# EAGLE board SteppyMk2 (EAGLE 9.2.2)
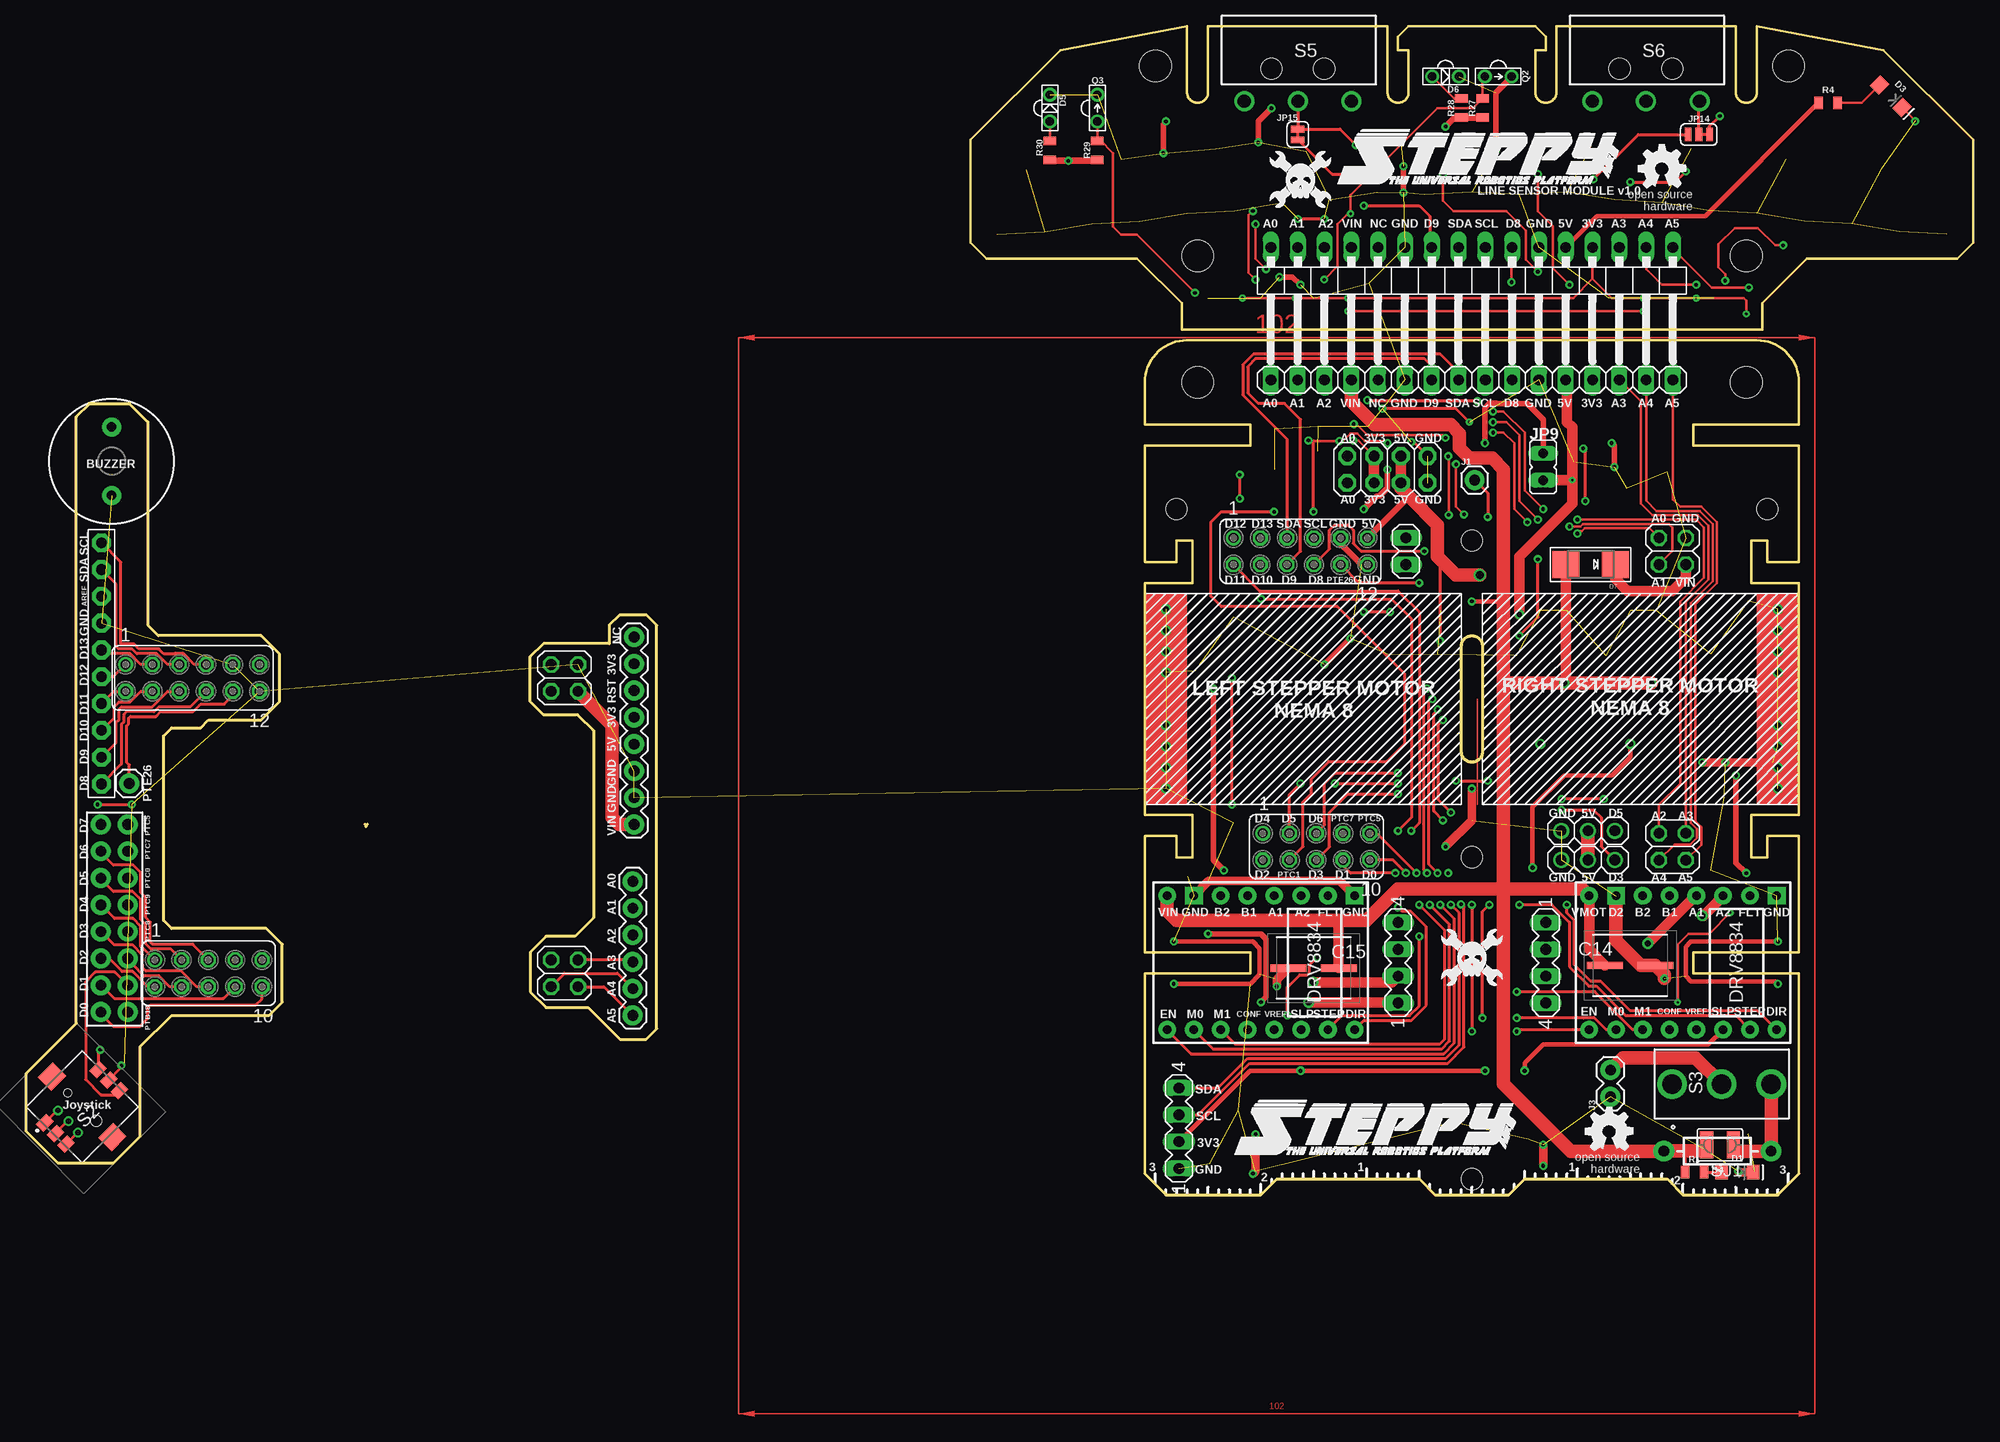
[diagram p1: board, top side]
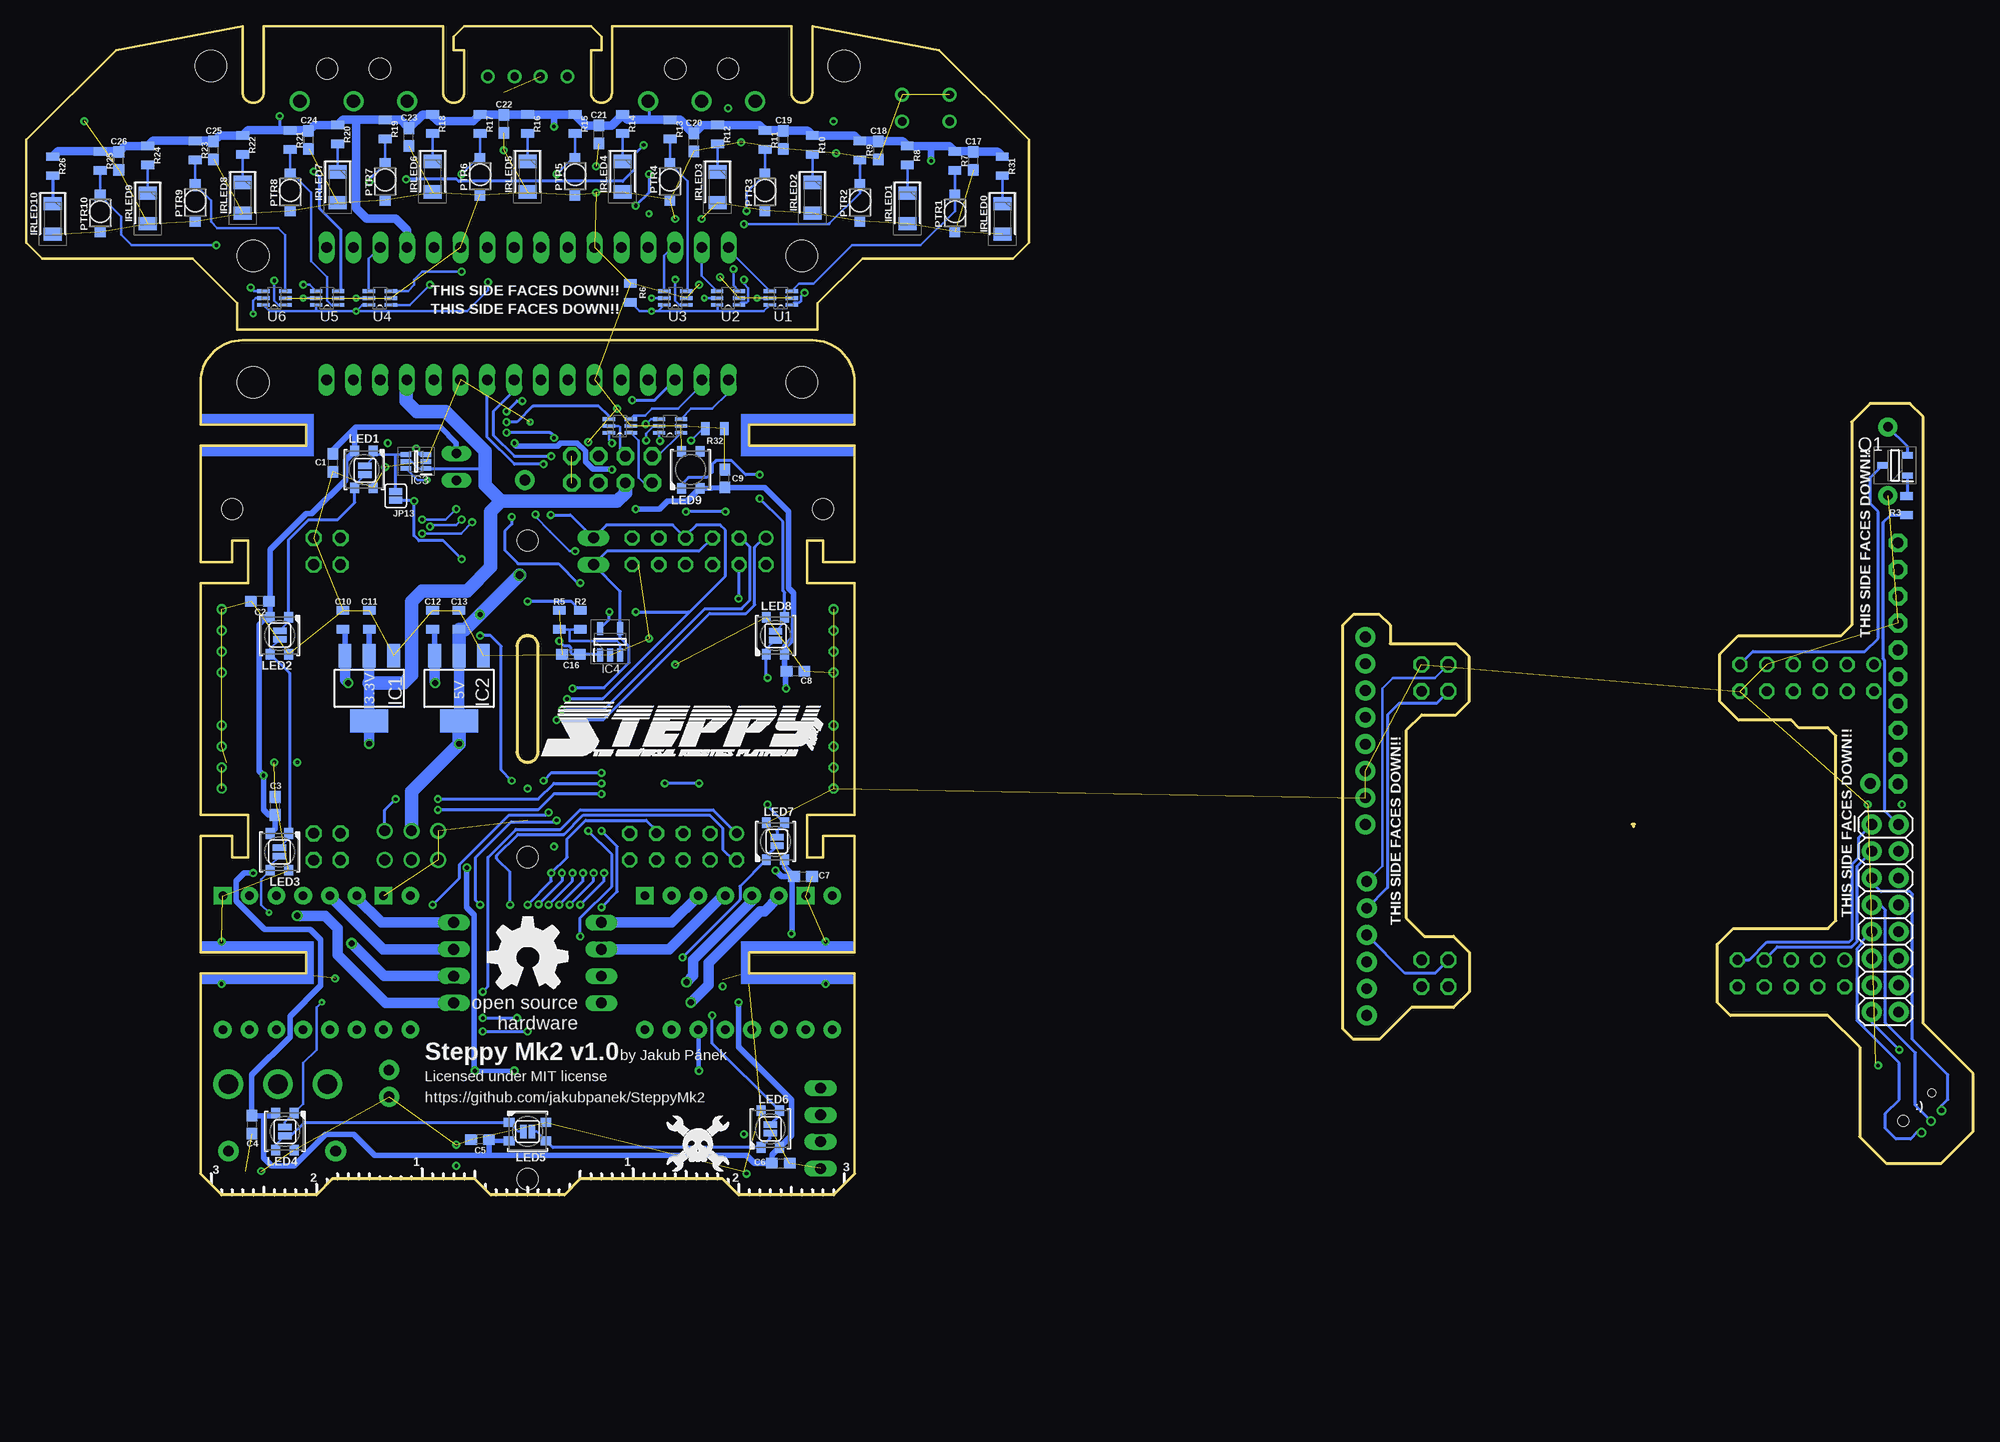
[diagram p2: board, bottom side, seen from below]

Size 184.5 x 110.75 mm. Coordinates in mm from the lower left corner, seen from the top.
Outline: 106,77 arc-90 110,81
Outline: 164,81 arc-90 168,77
Outline: 32.08,35.11 32.31,35.11
Outline: 32.18,35.09 32.18,34.91
Outline: 106,77 106,73 116,73 116,71 106,71 106,60 109,60 109,62 110.5,62 110.5,58 106,58 106,36 110.5,36 110.5,32 109,32 109,34 106,34 106,23 116,23 116,21 106,21 106,2 108,0 117,0 118.5,1.5 132,1.5 133.5,0 140.5,0 142,1.5 155.5,1.5 157,0 166,0 168,2 168,21 158,21 158,23 168,23 168,34 165,34 165,32 163.5,32 163.5,36 168,36 168,58 163.5,58 163.5,62 165,62 165,60 168,60 168,71 158,71 158,73 168,73 168,77
Outline: 106,77 arc-90 110,81
Outline: 110,81 164,81
Outline: 164,81 arc-90 168,77
Outline: 109.5,82 164.5,82 164.5,84.5 168.75,88.75 183,88.75 184.5,90.25 184.5,100 176,108.5 164,110.75 164,104.5 arc-90 163,103.5 arc-90 162,104.5 162,110.75 145,110.75 145,104.5 arc-90 144,103.5 arc-90 143,104.5 143,108.5 144,108.5 144,109.75 143,110.75 131,110.75 130,109.75 130,108.5 131,108.5 131,104.5 arc-90 130,103.5 arc-90 129,104.5 129,110.75 112,110.75 112,104.5 arc-90 111,103.5 arc-90 110,104.5 110,110.75 98,108.5 89.5,100 89.5,90.25 91,88.75 105.25,88.75 109.5,84.5 109.5,82
Outline: 8.25,3 3,3 0,6 0,11.51 4.74,16.25 4.74,73.75 5.99,75 9.75,75 11.5,73.25 11.5,54 12.5,53 22.25,53 24,51.25 24,46.75 22.25,45 17.25,45 16.5,44.25 13.75,44.25 13,43.5 13,26 13.75,25.25 22.75,25.25 24.25,23.75 24.25,18.25 23,17 13.75,17 10.75,14 10.75,5.5 8.25,3
Outline: 49.25,17.75 53.25,17.75 56.25,14.75 58.75,14.75 59.75,15.75 59.75,54 58.75,55 56.25,55 55.25,54 55.25,52.25 49,52.25 47.75,51 47.75,46.75 49,45.5 52.25,45.5 53.75,44 53.75,26.25 52,24.5 49.25,24.5 47.75,23 47.75,19.25 49.25,17.75
Outline: 136,42 136,52 arc-90 137,53 arc-90 138,52 138,42 arc-90 137,41 arc-90 136,42
Copper layers (1*16): Top 0.035mm / dielectric 1.5mm / Bottom 0.035mm
Design rules "default *": minimum track width 6mil, minimum drill 0.2mm, track to track 6mil, track to pad 6mil, pad to pad 6mil, via to via 6mil, smd to smd 6mil, copper to edge 0.2mm, drill to drill 6mil, minimum pad ring 10mil, minimum via ring 8mil, stop-mask expansion 4mil, vias tented up to drill 0mil, thermal gap 10mil
Holes 2 mm at 109,65 137,32 137,62 151,106.75 156,106.75 118,106.75 123,106.75 137,1.5 165,65
Holes 3 mm at 163,77 111,77 111,89 163,89 107,107 167,107

## Footprints (pad centres in the part's own frame; a part is rotated, then mirrored left to right if it is on the bottom)
0603 = smd 1.1 x 1: 1 -0.85,0; 2 0.85,0
0805 = smd 0.8 x 1.2: 1 -0.9,0; 2 0.9,0
CAPM7058X610N = smd 3.4 x 0.7: 1 -2.4,0; 2 2.4,0
POLOLU-DRV8825 = drill 0.8 pad 1.676: A1 6.35,-1.27; A2 6.35,-3.81; B1 6.35,1.27; B2 6.35,3.81; CONFIG -6.35,1.27; DIR -6.35,-8.89; EN -6.35,8.89; FLT 6.35,-6.35; M0 -6.35,6.35; M1 -6.35,3.81; SLP -6.35,-3.81; STEP -6.35,-6.35; VMOT 6.35,8.89; VREF -6.35,-1.27 | drill 0.8 pad 1.676 square: GND0 6.35,6.35; GND1 6.35,-8.89
LED-1206 = smd 1.2 x 1.4: A -1.5,0; C 1.5,0
DIODE-1N4001 = drill 1 pad 1.981: A -5.08,0; C 5.08,0
LTE-302 = drill 0.8: A 1.27,0; C -1.27,0
SMADIODE = smd 2.54 x 2.54: A 2.349,0; C -2.349,0
SOT223 = smd 1.219 x 2.235: 1 -2.311,-3.099; 2 0,-3.099; 3 2.311,-3.099 | smd 3.6 x 2.2: TAB 0,3.099
SOT65P210X110-6N = smd 1 x 0.45: 1 -0.95,0.65; 2 -0.95,0; 3 -0.95,-0.65; 4 0.95,-0.65; 5 0.95,0; 6 0.95,0.65
SOT95P280X145-5N = smd 1.2 x 0.6: 1 -1.25,0.95; 2 -1.25,0; 3 -1.25,-0.95; 4 1.25,-0.95; 5 1.25,0.95
LEDC3215X130N = smd 1.25 x 1.7: 1 -1.45,0; 2 1.45,0
1X01 = drill 1.016 pad 1.88: 1 0,0
1X02 = drill 1.016 pad 1.88: 1 0,0; 2 2.54,0
1X08 = drill 1.016 pad 1.88: 1 0,0; 2 2.54,0; 3 5.08,0; 4 7.62,0; 5 10.16,0; 6 12.7,0; 7 15.24,0; 8 17.78,0
1X06 = drill 1.016 pad 1.88: 1 0,0; 2 2.54,0; 3 5.08,0; 4 7.62,0; 5 10.16,0; 6 12.7,0
2X8 = drill 1.016 pad 1.88: 1 0,0; 2 0,2.54; 3 2.54,0; 4 2.54,2.54; 5 5.08,0; 6 5.08,2.54; 7 7.62,0; 8 7.62,2.54; 9 10.16,0; 10 10.16,2.54; 11 12.7,0; 12 12.7,2.54; 13 15.24,0; 14 15.24,2.54; 15 17.78,0; 16 17.78,2.54
SMT-JUMPER_2_NC_PASTE_SILK = smd 0.635 x 1.27: 1 -0.406,0; 2 0.406,0
JP1 = drill 0.914 long: 1 0,-1.27; 2 0,1.27
1X16/90 = drill 1.016 long: 1 -19.05,-3.81; 2 -16.51,-3.81; 3 -13.97,-3.81; 4 -11.43,-3.81; 5 -8.89,-3.81; 6 -6.35,-3.81; 7 -3.81,-3.81; 8 -1.27,-3.81; 9 1.27,-3.81; 10 3.81,-3.81; 11 6.35,-3.81; 12 8.89,-3.81; 13 11.43,-3.81; 14 13.97,-3.81; 15 16.51,-3.81; 16 19.05,-3.81
1X16 = drill 1.016 long: 1 -19.05,0; 2 -16.51,0; 3 -13.97,0; 4 -11.43,0; 5 -8.89,0; 6 -6.35,0; 7 -3.81,0; 8 -1.27,0; 9 1.27,0; 10 3.81,0; 11 6.35,0; 12 8.89,0; 13 11.43,0; 14 13.97,0; 15 16.51,0; 16 19.05,0
2X04 = drill 1.016 pad 1.676 octagon: 1 -3.81,-1.27; 2 -3.81,1.27; 3 -1.27,-1.27; 4 -1.27,1.27; 5 1.27,-1.27; 6 1.27,1.27; 7 3.81,-1.27; 8 3.81,1.27
SMT-JUMPER_3_1-NC_TRACE_SILK = smd 0.635 x 1.27: 1 -1.016,0; 2 0,0; 3 1.016,0
SMT-JUMPER_2_NC_TRACE_SILK = smd 0.635 x 1.27: 1 -0.508,0; 2 0.508,0
2X02 = drill 1.016 octagon: 1 -1.27,-1.27; 2 -1.27,1.27; 3 1.27,-1.27; 4 1.27,1.27
1X03 = drill 1.016: 1 -2.54,0; 2 0,0; 3 2.54,0
1X02' = drill 1.016 long: 1 -1.27,0; 2 1.27,0
LED3535 = smd 1 x 0.85: 1 -1.75,0.875; 2 -1.75,-0.875; 3 1.75,-0.875; 4 1.75,0.875
BUZZER-12MM = drill 0.9 pad 1.778: + 3.25,0; - -3.25,0
TEMT1020 = smd 1.1 x 1: 1 -1.7,0; 2 1.7,0
SOT96P237X111-3N = smd 1 x 0.6: 1 -1.2,0.955; 2 -1.2,-0.955; 3 1.2,0
LTR-301 = drill 0.8: C 1.27,0; E -1.27,0
SKRHABE010 = smd 1.35 x 1: 1 -3.575,1.425; 2 -3.575,0; 3 -3.575,-1.425; 4 3.575,1.425; 5 3.575,0; 6 3.575,-1.425 | smd 2 x 1.8: 7 0,4.05; 8 0,-4.05 | hole 0.75: 0,1.9 | hole 1.05: 0,-1.9
5MS1S102AM2QES = drill 1.85 pad 2.8: 1 0,-4.7; 2 0,0; 3 0,4.7
AH186061A = drill 1.25 pad 1.9: 1 -5.08,1.6; 2 0,1.6; 3 5.08,1.6
SJW = smd 1.27 x 2.54: 1 -1.27,0; 2 1.27,0
MA04-1 = drill 1.016 long: 1 -3.81,0; 2 -1.27,0; 3 1.27,0; 4 3.81,0
FE05-2 = drill 0.914: 1 -5.08,1.27 | drill 0.914 octagon: 2 -5.08,-1.27; 3 -2.54,1.27; 4 -2.54,-1.27; 5 0,1.27; 6 0,-1.27; 7 2.54,1.27; 8 2.54,-1.27; 9 5.08,1.27; 10 5.08,-1.27
FE06-2 = drill 0.914: 1 -6.35,1.27 | drill 0.914 octagon: 2 -6.35,-1.27; 3 -3.81,1.27; 4 -3.81,-1.27; 5 -1.27,1.27; 6 -1.27,-1.27; 7 1.27,1.27; 8 1.27,-1.27; 9 3.81,1.27; 10 3.81,-1.27; 11 6.35,1.27; 12 6.35,-1.27
SOT65P210X110-6N' = smd 1.168 x 0.356: 1 -1.041,0.66; 2 -1.041,0; 3 -1.041,-0.66; 4 1.041,-0.66; 5 1.041,0; 6 1.041,0.66
1X10-BIG = drill 1.016 pad 1.778 octagon: 1 -11.43,0; 2 -8.89,0; 3 -6.35,0; 4 -3.81,0; 5 -1.27,0; 6 1.27,0; 7 3.81,0; 8 6.35,0; 9 8.89,0; 10 11.43,0

## Placement (x,y rotation side)
C1  0.1uF  [0603]  155.46,69.39 270 bottom
C2  0.1uF  [0603]  162.36,56.27 180 bottom
C3  0.1uF  [0603]  160.92,36.86 90 bottom
C4  0.1uF  [0603]  163.14,6.64 270 bottom
C5  0.1uF  [0603]  141.5,5.25 180 bottom
C6  0.1uF  [0603]  113,3 0 bottom
C7  0.1uF  [0603]  110.89,30.18 0 bottom
C8  0.1uF  [0603]  111.61,49.63 0 bottom
C9  0.1uF  [0603]  118.31,67.89 90 bottom
C10  10uF  [0805]  154.5,54.5 90 bottom
C11  10uF  [0805]  152,54.5 90 bottom
C12  10uF  [0805]  146,54.5 90 bottom
C13  10uF  [0805]  143.5,54.5 90 bottom
C14  100UF  [CAPM7058X610N]  152,21.75 180 top
C15  100UF  [CAPM7058X610N]  122,21.5 0 top
C16  0.1uF  [0603]  132.88,51.23 180 bottom
C17  0.1uF  [0603]  94.75,98 90 bottom
C18  0.1uF  [0603]  103.75,99 90 bottom
C19  0.1uF  [0603]  112.75,100 90 bottom
C20  0.1uF  [0603]  121.25,99.75 90 bottom
C21  0.1uF  [0603]  130.25,100.5 90 bottom
C22  0.1uF  [0603]  139.25,101.5 90 bottom
C23  0.1uF  [0603]  148.25,100.25 90 bottom
C24  0.1uF  [0603]  157.75,100 90 bottom
C25  0.1uF  [0603]  166.75,99 90 bottom
C26  0.1uF  [0603]  175.75,98 90 bottom
CONLEFT  POLOLU-DRV8825  [POLOLU-DRV8825]  157,22 90 top
D1  GREEN  [LED-1206]  162.15,2.15 0 top
D3  GREEN  [LED-1206]  176.7,104.14 315 top
D4  P2000A  [DIODE-1N4001]  160.27,4.14 180 top
D5  [LTE-302]  97,103 270 top
D6  [LTE-302]  134.5,106 180 top
D7  [SMADIODE]  148.25,59.75 180 top
GOLD_ORB_SM1  OSHWLOGOLOGO8MM  [OSHW_8MM]  137,22.5 0 bottom
GOLD_ORB_SM2  OSHWLOGOLOGO5MM  [OSHW_5MM]  150,6 0 top
GOLD_ORB_SM3  OSHWLOGOLOGO5MM  [OSHW_5MM]  155,97.25 0 top
IC1  AP1117E33G-13  [SOT223]  152,48 180 bottom
IC2  TS1117BCW-5.0  [SOT223]  143.5,48 180 bottom
IC3  74LVC1T45GW,125  [SOT65P210X110-6N]  147.57,69.51 180 bottom
IC4  MCP3021A0T-E_OT  [SOT95P280X145-5N]  129.17,52.42 90 bottom
IRLED0  LL-S150IRC-2A  [LEDC3215X130N]  92,92.5 270 bottom
IRLED1  LL-S150IRC-2A  [LEDC3215X130N]  101,93.5 270 bottom
IRLED2  LL-S150IRC-2A  [LEDC3215X130N]  110,94.5 270 bottom
IRLED3  LL-S150IRC-2A  [LEDC3215X130N]  119,95.5 270 bottom
IRLED4  LL-S150IRC-2A  [LEDC3215X130N]  128,96.5 270 bottom
IRLED5  LL-S150IRC-2A  [LEDC3215X130N]  137,96.5 270 bottom
IRLED6  LL-S150IRC-2A  [LEDC3215X130N]  146,96.5 270 bottom
IRLED7  LL-S150IRC-2A  [LEDC3215X130N]  155,95.5 270 bottom
IRLED8  LL-S150IRC-2A  [LEDC3215X130N]  164,94.5 270 bottom
IRLED9  LL-S150IRC-2A  [LEDC3215X130N]  173,93.5 270 bottom
IRLED10  LL-S150IRC-2A  [LEDC3215X130N]  182,92.5 270 bottom
J1  [1X01]  137.25,67.75 0 top
J3  [1X02]  150.13,9.29 90 top
J5  [1X08]  57.59,52.88 270 top
J6  [1X06]  57.47,29.71 270 top
J7  [1X01]  9.75,39 0 top
J8  [2X8]  9.6,35.1 270 bottom
JP1  JUMPER-SMT_2_NC_PASTE_SILK  [SMT-JUMPER_2_NC_PASTE_SILK]  152.4,68.68 270 bottom
JP2  JUMPER-SMT_2_NC_PASTE_SILK  [SMT-JUMPER_2_NC_PASTE_SILK]  160.48,53.06 270 bottom
JP3  JUMPER-SMT_2_NC_PASTE_SILK  [SMT-JUMPER_2_NC_PASTE_SILK]  160.5,32.5 270 bottom
JP4  JUMPER-SMT_2_NC_PASTE_SILK  [SMT-JUMPER_2_NC_PASTE_SILK]  160,6 270 bottom
JP5  JUMPER-SMT_2_NC_PASTE_SILK  [SMT-JUMPER_2_NC_PASTE_SILK]  137,6 0 bottom
JP6  JUMPER-SMT_2_NC_PASTE_SILK  [SMT-JUMPER_2_NC_PASTE_SILK]  114,6.25 90 bottom
JP7  JUMPER-SMT_2_NC_PASTE_SILK  [SMT-JUMPER_2_NC_PASTE_SILK]  113.36,33.5 90 bottom
JP8  JUMPER-SMT_2_NC_PASTE_SILK  [SMT-JUMPER_2_NC_PASTE_SILK]  113.5,53 90 bottom
JP9  [JP1]  143.75,69 180 top
JP10  [1X16/90]  137,86 180 top
JP11  [1X16]  137,77.25 0 top
JP12  [2X04]  129,68.75 0 top
JP13  JUMPER-SMT_2_NC_PASTE_SILK  [SMT-JUMPER_2_NC_PASTE_SILK]  149.5,66.25 90 bottom
JP14  JUMPER-SMT_3_1-NC_TRACE_SILK  [SMT-JUMPER_3_1-NC_TRACE_SILK]  158.5,100.5 0 top
JP15  JUMPER-SMT_2_NC_TRACE_SILK  [SMT-JUMPER_2_NC_TRACE_SILK]  120.5,100.5 90 top
JP21  [2X02]  51,49 270 top
JP22  [2X02]  51,21 270 top
JP23  [2X02]  156,61 270 top
JP24  [1X03]  148,34.5 0 top
JP25  [1X03]  148,31.75 0 top
JP26  [2X02]  156,33 270 top
JP27  [1X02']  130.75,61 90 top
LED1  WS2812B3535  [LED3535]  152.5,68.75 270 bottom
LED2  WS2812B3535  [LED3535]  160.5,53 270 bottom
LED3  WS2812B3535  [LED3535]  160.5,32.5 270 bottom
LED4  WS2812B3535  [LED3535]  160,6 270 bottom
LED5  WS2812B3535  [LED3535]  137,6 0 bottom
LED6  WS2812B3535  [LED3535]  114,6.25 90 bottom
LED7  WS2812B3535  [LED3535]  113.5,33.5 90 bottom
LED8  WS2812B3535  [LED3535]  113.5,53 90 bottom
LED9  WS2812B3535  [LED3535]  121.54,68.73 90 bottom
LS1  BUZZER-PTH  [BUZZER-12MM]  8.08,69.53 90 top
PTR1  TEMT1020  [TEMT1020]  96.5,93 270 bottom
PTR2  TEMT1020  [TEMT1020]  105.5,94 270 bottom
PTR3  TEMT1020  [TEMT1020]  114.5,95 270 bottom
PTR4  TEMT1020  [TEMT1020]  123.5,96 270 bottom
PTR5  TEMT1020  [TEMT1020]  132.5,96.5 270 bottom
PTR6  TEMT1020  [TEMT1020]  141.5,96.5 270 bottom
PTR7  TEMT1020  [TEMT1020]  150.5,96 270 bottom
PTR8  TEMT1020  [TEMT1020]  159.5,95 270 bottom
PTR9  TEMT1020  [TEMT1020]  168.5,94 270 bottom
PTR10  TEMT1020  [TEMT1020]  177.5,93 270 bottom
Q1  SBC817-40LT1G  [SOT96P237X111-3N]  7.4,69.13 180 bottom
Q2  [LTR-301]  139.5,106 180 top
Q3  [LTR-301]  101.5,103 270 top
R1  1K  [0805]  158.09,2.14 0 top
R2  10K  [0805]  132,54.5 270 bottom
R3  4.7K  [0805]  6.31,65.33 270 bottom
R4  330  [0805]  170.75,103.5 0 top
R5  10K  [0805]  134,54.5 90 bottom
R6  330K  [0805]  127.25,85.5 270 bottom
R7  10K  [0805]  96.5,98 270 bottom
R8  330  [0805]  101,98.5 270 bottom
R9  10K  [0805]  105.5,99 270 bottom
R10  330  [0805]  110,99.5 270 bottom
R11  10K  [0805]  114.5,100 270 bottom
R12  330  [0805]  119,100.5 270 bottom
R13  10K  [0805]  123.5,101 270 bottom
R14  330  [0805]  128,101.5 270 bottom
R15  10K  [0805]  132.5,101.5 270 bottom
R16  330  [0805]  137,101.5 270 bottom
R17  10K  [0805]  141.5,101.5 270 bottom
R18  330  [0805]  146,101.5 270 bottom
R19  10K  [0805]  150.5,101 270 bottom
R20  330  [0805]  155,100.5 270 bottom
R21  10K  [0805]  159.5,100 270 bottom
R22  330  [0805]  164,99.5 270 bottom
R23  10K  [0805]  168.5,99 270 bottom
R24  330  [0805]  173,98.5 270 bottom
R25  10K  [0805]  177.5,98 270 bottom
R26  330  [0805]  182,97.5 270 bottom
R27  10K  [0805]  138,103 90 top
R28  330  [0805]  136,103 90 top
R29  10K  [0805]  101.5,99 90 top
R30  330  [0805]  97,99 90 top
R31  330  [0805]  92,97.5 270 bottom
R32  330K  [0805]  119.25,72.62 180 bottom
S2  SKRHABE010  [SKRHABE010]  5.28,8.34 45 top
S3  5MS1S102AM2QES  [5MS1S102AM2QES]  160.67,10.51 270 top
S5  AH186061A  [AH186061A]  120.5,105.25 180 top
S6  AH186061A  [AH186061A]  153.5,105.25 180 top
SJ1  [SJW]  160.5,4.75 180 top
SV1  [MA04-1]  130,22 90 top
SV2  [MA04-1]  144,22 270 top
SV3  [MA04-1]  109.23,6.31 90 top
SV4  [FE05-2]  17.25,21 0 top
SV5  [FE06-2]  15.75,49 0 top
SV6  [FE05-2]  122.25,33 0 top
SV7  [FE06-2]  120.75,61 0 top
U1  NC7SB3157P6X  [SOT65P210X110-6N']  113,85 180 bottom
U2  NC7SB3157P6X  [SOT65P210X110-6N']  118,85 180 bottom
U3  NC7SB3157P6X  [SOT65P210X110-6N']  123,85 180 bottom
U4  NC7SB3157P6X  [SOT65P210X110-6N']  151,85 180 bottom
U5  NC7SB3157P6X  [SOT65P210X110-6N']  156,85 180 bottom
U6  NC7SB3157P6X  [SOT65P210X110-6N']  161,85 180 bottom
U7  NC7SB3157P6X  [SOT65P210X110-6N']  123.5,72.88 180 bottom
U8  NC7SB3157P6X  [SOT65P210X110-6N']  128.25,72.88 180 bottom
U$1  PINHD-1X10  [1X10-BIG]  7.12,50.38 90 top
U$2  POLOLU-DRV8825  [POLOLU-DRV8825]  117,22 90 top

## Tracks (layer width: path | path; a pad name or v marks a point on that pad's centre or on a via)
3V3REG  (via drill 0.35, 0.4, 0.55)
  Top 0.254: JP12.4 126.25,71.5 v125.75,71.5
  Top 0.406: SV3.2 115.94,11.75 v120.75,11.75 v138.25,11.75 | v142,11.75 142,12.5 143.75,14.25 159.41,14.25 CONLEFT.SLP | v142.75,31 142.75,36.75 145.75,39.75 150.25,39.75 152,41.5 v152,42.75
  Top 1.016: JP12.3 JP12.4
  Bottom 0.254: IC3.1 147.36,68.86 147.93,69.43 148.45,69.43 | JP12.4 128.25,70.54 128.25,72.75 128.38,72.88 U8.5 | U7.5 124.59,72.92 124.99,72.92 125.75,72.16 v125.75,71.5
  Bottom 0.305: 148.45,69.43 IC3.5 | IC3.1 141.11,68.86 141,68.75
  Bottom 0.406: v120.75,11.75 120.81,11.81 U$2.SLP | v138.25,11.75 v142,11.75
  Bottom 0.508: IC1.2 C11.1 | v142.75,31 142.78,30.97 142.78,27.26 142.07,26.54 142.07,11.82 v142,11.75
  Bottom 1.016: IC1.2 152,48.5 IC1.TAB v152,42.75
  Bottom 1.27: 152,48.5 148.75,48.5 148,49.25 148,56.25 147,57.25 142.75,57.25 140.5,59.5 140.5,64.75 139.5,65.75 | JP12.3 127.73,66.52 128.5,65.75 139.5,65.75 | 139.5,65.75 141,67.25 141,68.75 141,70.5 144.75,74.25 147.5,74.25 148.5,75.25 148.5,77.18 JP11.13
3V3REG_  (via drill 0.25, 0.35)
  Top 0.254: v115.25,85 v120.25,85 v125.25,85 146.62,85 148.43,86.82 | 148.43,86.82 150.25,85 v153.25,85 v158.25,85 162.77,85 163,84.77 v163,83.5 | 148.43,86.82 JP10.4
  Top 0.305: JP14.3 159.52,101.27 v160.5,102.25
  Top 0.61: R30.1 97.1,98 v98.75,98 101.4,98 R29.1 | v134.5,101.25 135.35,102.1 R28.1 R27.1
  Bottom 0.254: U2.5 v120.25,85 | v115.25,85 U1.5 | U3.5 v125.25,85 | U4.5 v153.25,85 | U5.5 v158.25,85 | U6.5 162.75,85 163,84.75 v163,83.5
  Bottom 0.305: v160.5,102.25 160.5,100.9 | S5.1 125.5,103.57 125.5,101.9 | R18.1 146.17,102.4
  Bottom 0.61: 98.5,99.4 98.75,99.15 v98.75,98 | 134.5,102.4 v134.5,101.25
  Bottom 0.813: 139.2,102.4 arc-90 C22.2 | R26.1 181.5,98.9 R25.1 175.8,98.9 C26.2 175.2,99.4 R24.1 172.5,99.9 R23.1 166.8,99.9 C25.2 166.2,100.4 R22.1 163.5,100.9 160.5,100.9 R21.1 157.8,100.9 C24.2 157.2,101.4 R20.1 154.5,101.9 153.25,101.9 | 153.25,101.9 R19.1 149.05,101.9 C23.2 146.95,102.4 146.17,102.4 145.52,101.75 142.15,101.75 R17.1 139.3,102.4 C22.2 | C22.2 139.2,102.4 | 139.2,102.4 R16.1 134.5,102.4 R15.1 131.45,101.35 C21.2 129.05,101.35 R14.1 127.5,101.9 125.5,101.9 R13.1 122.55,101.9 C20.2 120.45,101.4 R12.1 115,101.4 R11.1 112.8,100.9 C19.2 110.45,100.85 R10.1 106,100.4 R9.1 103.8,99.9 C18.2 101.45,99.85 R8.1 98.5,99.4 97,99.4 R7.1 94.8,98.9 C17.2 92.45,98.85 R31.1 | JP10.4 148.43,91.43 149.5,92.5 152.25,92.5 153.25,93.5 153.25,101.9
5VREG  (via drill 0.2, 0.35, 0.5, 0.55, 0.75)
  Top 0.305: v134,52.5 134,60.25 133.75,60.5
  Top 0.406: 130.75,65.92 130.95,66.12 131.12,66.12
  Top 0.508: SV7.11 130.75,65.92
  Top 1.016: v141.5,55 141.5,60.5 146.5,65.5 v146.5,67.75 | JP12.5 JP12.6 | v146.5,67.75 146.5,72.75 146,73.25 146,77.14 JP11.12 | JP9.2 146.48,67.73 v146.5,67.75
  Top 1.27: v137.75,58.75 135.5,58.75 133.75,60.5 133.75,63.5 131.12,66.12 130.27,66.98 JP12.5 | JP25.2 JP24.2
  Bottom 0.254: IC3.6 147.41,67.75 v146.5,67.75
  Bottom 0.305: IC4.1 130.19,51.23 C16.1 132.73,51.23 132.87,51.37 132.87,51.86 133.05,52.04 133.54,52.04 v134,52.5
  Bottom 1.016: IC2.TAB IC2.2
  Bottom 1.27: JP24.2 148,38.25 v143.5,42.75 IC2.TAB | IC2.2 C13.1 142.9,53.6 v141.5,55 v137.75,58.75
5VREG*
  Bottom 0.305: SV5.11 20.87,51.5 10.25,51.5 9,52.75 9,64.75 9.75,65.5 9.75,67.98 Q1.3
5VREG_
  Top 0.406: JP10.5 148.83,92.75 159.1,92.75 R4.1
A0  (via drill 0.35)
  Top 0.254: JP23.1 153.81,63.19 147.69,63.19 147.44,62.94 147.25,62.94 v147,62.69 | v139,72.25 140,72.25 141,71.25 141,65 v142.25,63.75 | v125.8,73.05 126.05,73.05 127.1,72 134.25,72 v134.5,71.75
  Bottom 0.254: v147,62.69 143.31,62.69 v142.25,63.75 | U7.4 125.32,73.53 v125.8,73.05
  Bottom 0.305: v134.5,71.75 arc-90 135,72.25 v139,72.25
A0*
  Bottom 0.254: JP21.1 51,49 55,49 56,48 56,31.17 J6.1
A0A
  Bottom 0.254: R7.2 PTR1.1 96.5,93.25 99.75,90 106.26,90 109.91,86.36 111.26,86.36 U1.3
A0B  (via drill 0.35)
  Top 0.254: R29.2 101.5,100 | 101.5,100 Q3.C | 101.5,100 101.75,100 103,98.75 103,91.75 103.75,91 105.25,91 v110.75,85.5
  Bottom 0.254: v110.75,85.5 110.8,85.5 111.09,85.2 111.09,84.71 111.26,84.54 111.75,84.54 U1.1
A0C
  Bottom 0.254: U7.3 121.49,74.5 119.5,74.5 117.95,76.05 JP11.1
A0D
  Bottom 0.254: U7.1 124.67,70 125.17,70 JP12.2
A0S
  Bottom 0.254: U1.4 117.95,89.57 JP10.16
A1  (via drill 0.35)
  Top 0.254: JP23.3 156,61 156,63.25 155.66,63.59 147.52,63.59 147.27,63.34 v146.25,63.34 | v139,73.25 140.25,73.25 141.5,72 141.5,65.75 v143.25,64
  Bottom 0.254: v146.25,63.34 146.25,63.5 143.75,63.5 v143.25,64
  Bottom 0.305: U8.4 129.29,73.79 130.25,74.75 136.5,74.75 138,73.25 v139,73.25
A1*
  Bottom 0.305: J6.2 55.5,29.13 55.5,45.5 54.41,46.59 50.87,46.59 JP21.3
A1A  (via drill 0.35)
  Top 0.254: v117.5,87.75 116.5,88.75 v116.5,92
  Bottom 0.254: R9.2 PTR2.1 105.5,94.95 108.37,92.08 108.37,92.06 108.43,92 v116.5,92 | U2.3 117.5,86.2 v117.5,87.75
A1B  (via drill 0.35)
  Top 0.254: v116.25,93.25 115.84,92.84 115.84,87.41 v116.5,86.75
  Bottom 0.254: R11.2 114.5,96.75 | 114.5,96.75 PTR3.1 | U2.1 116.75,84.54 116.26,84.54 116.09,84.71 116.09,85.95 116.5,86.36 v116.5,86.75 | v116.25,93.25 116.25,95 114.5,96.75
A1C
  Bottom 0.254: U8.3 126.9,73.84 125.86,73.84 125.2,74.5 122.75,74.5 120.49,76.76 JP11.2
A1D
  Bottom 0.254: JP12.1 125.98,67.48 126.5,68 126.5,71.51 U8.1
A1S
  Bottom 0.254: U2.4 120.49,87.11 JP10.15
A2  (via drill 0.35)
  Top 0.254: JP26.1 154.73,36.98 156.75,39 156.75,56.25 159,58.5 159,63.25 158.25,64 v147,64 | v143.75,65 142,66.75 142,72.25 140,74.25 v139,74.25
  Top 0.305: v137.5,75.25 127.15,75.25 v127.07,75.32
  Bottom 0.254: v147,64 144.75,64 v143.75,65
  Bottom 0.305: v139,74.25 138,75.25 v137.5,75.25 | JP11.3 124.96,75.32 v127.07,75.32
A2*
  Bottom 0.305: JP22.1 51,21 53.84,21 J6.3
A2A
  Bottom 0.254: R13.2 123.5,97.75 | 123.5,97.75 PTR4.1 | U3.3 121.81,85.81 121.81,96.06 123.5,97.75
A2B  (via drill 0.25, 0.3)
  Top 0.254: Q2.C 138,105.77 R27.2 137.1,103 133.75,103 125.5,94.75 v125.5,93 125.25,93 124.25,92 124.25,90.55 124.25,88 v123,86.75
  Bottom 0.254: U3.1 122.59,84.34 123,84.75 v123,86.75
A2S
  Bottom 0.254: U3.4 124.04,89.04 123.27,89.81 JP10.14
A3
  Top 0.254: JP26.2 157.27,56.2 159.41,58.33 159.41,63.42 158.42,64.41 154.09,64.41 153,65.5 153,75.22 JP11.14
A3*
  Top 0.305: J6.4 57.28,22.27 JP22.2
A3A  (via drill 0.35 pad 0.6)
  Top 0.254: v143.25,87.5 142.13,88.62 142.13,91.37 140.25,93.25 135.25,93.25 134.25,94.25 v134.25,96.75
  Bottom 0.254: R15.2 PTR5.1 132.8,98.2 v134.25,96.75 | v143.25,87.5 147,87.5 147.75,86.75 147.75,86.25 148.34,85.66 U4.3
A3B  (via drill 0.35 pad 0.6)
  Top 0.254: v146.25,86.25 144.67,87.83 144.67,91.83 143.25,93.25 v143.25,96.75
  Bottom 0.254: R17.2 PTR6.1 141.8,98.2 v143.25,96.75 | U4.1 148.16,84.34 v146.25,86.25
A3S
  Bottom 0.254: U4.4 152.04,88.72 150.97,89.79 JP10.3
A4
  Top 0.254: JP26.3 156.23,33.23 157.7,33.23 158.31,33.84 158.31,34.7 157.75,35.26 157.75,56.1 159.81,58.16 159.81,63.59 158.59,64.81 154.5,64.81 153.51,65.8 JP11.15
A4*
  Top 0.254: J6.5
  Top 0.305: JP22.3 51,21 56.01,21 J6.5
A4A  (via drill 0.35)
  Top 0.305: v152,96 156.25,96 v157.25,97
  Bottom 0.254: R19.2 PTR7.1
  Bottom 0.305: PTR7.1 152,96.2 v152,96 | v157.25,97 156.75,96.5 156.75,93.5 154.71,91.46 154.71,85.71 154.76,85.66 U5.3
A4B
  Bottom 0.254: R21.2 159.5,96.75 | 159.5,96.75 PTR8.1 | U5.1 155.59,84.34 156,84.75 156,87 157.5,88.5 157.5,95 159.25,96.75 159.5,96.75
A4S  (via drill 0.35 pad 0.6)
  Top 0.254: JP10.2 153.51,87.74 155,86.25 v158.25,86.25
  Bottom 0.254: U5.4 157.63,86.25 v158.25,86.25
A5
  Top 0.254: JP26.4 158.72,33.18 158.72,34.87 158.16,35.43 158.16,55.93 160.22,57.99 160.22,63.75 158.75,65.22 156.75,65.22 156.05,65.92 JP11.16
A5*
  Top 0.305: JP22.4 54.75,19.73 J6.6
A5A
  Bottom 0.254: R23.2 PTR9.1 168.45,95.7 167,94.25 167,92.25 166.39,91.64 160.64,91.64 159.96,90.96 U6.3
A5B  (via drill 0.35)
  Top 0.254: v161,86.66 161,87.26 160.36,87.91 160.36,90.09 161.91,91.64 164.09,91.64 165.74,90 v166.5,90
  Bottom 0.254: R25.2 PTR10.1 175.5,92.7 175.5,91 174.5,90 v166.5,90 | U6.1 160.59,84.34 161,84.75 v161,86.66
A5S  (via drill 0.35)
  Top 0.254: JP10.1 156.05,89.7 159.75,86 v163.25,86
  Bottom 0.254: v163.25,86 162.91,85.66 U6.4
D0  (via drill 0.35)
  Top 0.305: U$2.M0 112.47,13.83 134.14,13.83 134.88,14.57 134.88,25.62 v133,27.5 | v130.75,30.5 129.52,31.73 SV6.10
  Bottom 0.305: v133,27.5 130.75,29.75 v130.75,30.5
D0*
  Top 0.305: J8.16 7.06,17.15 8.25,15.96 10.75,15.96 11.5,16.71 11.5,17.75 11.75,18 21.75,18 22.33,18.58 SV4.10
D1  (via drill 0.35)
  Top 0.305: U$2.M1 114.55,14.29 133.95,14.29 134.42,14.76 134.42,25.08 v132,27.5 | v129.75,30.5 125.5,30.5 124.79,31.21 SV6.8
  Bottom 0.305: v132,27.5 129.75,29.75 v129.75,30.5
D1*
  Top 0.305: J8.14 8.3,18.62 18.68,18.62 SV4.8
D2  (via drill 0.35)
  Top 0.305: CONLEFT.M0 149.73,15.65 148.58,16.79 147.64,16.79 147.59,16.75 v141.25,16.75 | v138,16.75 138,26.84 v138.66,27.5
  Bottom 0.305: v141.25,16.75 v138,16.75 | v138.66,27.5 138.66,30.59 139.92,31.85 139.92,32.15 137.9,34.17 133.55,34.17 131.72,36 119.75,36 118.5,34.75 118.5,32.75 117.48,31.73 SV6.2
D2*
  Top 0.305: SV4.2 11.49,19.73 10.06,21.16 9.08,21.16 7.84,22.41 J8.12
D3  (via drill 0.35)
  Top 0.305: SV6.6 123.5,32.98 123.5,36.25 125.25,38 v130,38 | v145.5,36.5 148.5,36.5 149.25,35.75 149.25,33.04 JP25.3
  Bottom 0.305: v130,38 134.5,38 136,36.5 v145.5,36.5
D3*
  Top 0.305: SV4.6 16.15,19.73 14.67,21.2 11.33,21.2 11.02,21.51 11,22.25 11,22.76 10.06,23.7 8.3,23.7 J8.10
D4  (via drill 0.35)
  Top 0.305: CONLEFT.M1 152.27,15.65 148.66,19.26 142.8,19.26 142.79,19.25 v141.25,19.25
  Bottom 0.305: v141.25,19.25 140.75,19.75 140.75,32 138.11,34.64 133.86,34.64 132,36.5 119.4,36.5 SV6.1
D4*
  Top 0.305: SV4.1 10.94,23.5 10.91,23.5 10.83,23.58 10.83,24.42 10.84,24.43 10.84,25.46 10.11,26.19 8.35,26.19 J8.8
D5  (via drill 0.35)
  Top 0.305: SV6.3 119.71,37.96 v120.75,39 | v124,39 v130,39 | v149.5,37.5 v145.5,37.5
  Bottom 0.305: v120.75,39 v124,39 | JP24.3 150.54,36.46 v149.5,37.5 | v145.5,37.5 136,37.5 134.5,39 v130,39
D5*
  Top 0.305: SV4.3 13.69,23.29 11.8,23.29 11.3,23.79 11.3,25.65 10.84,26.11 10.84,28 10.09,28.75 8.25,28.75 7.06,29.94 J8.6
D6  (via drill 0.35)
  Top 0.305: SV6.5 123.04,35.06 123.04,39.01 124.03,40 v130,40 | v135.5,39.25 v138.5,39.25 | v141.5,53 143.25,54.75 v143.25,60.25 | v147.75,65.75 147.75,70.54 v147.54,70.75
  Bottom 0.305: v130,40 134.75,40 v135.5,39.25 | v138.5,39.25 139.5,40.25 139.5,52 140.5,53 v141.5,53 | v143.25,60.25 145,62 147.28,62 147.75,62.47 v147.75,65.75 147.84,65.84 JP13.1 | v147.54,70.75 147.54,70.5 147.19,70.16 IC3.3
D6*
  Top 0.305: SV4.5 15.78,23.74 12.01,23.74 11.76,23.99 11.76,25.84 11.3,26.3 11.3,28.19 10.84,28.65 10.84,30.54 10.11,31.27 9.08,31.27 9.06,31.25 8.25,31.25 7.06,32.44 J8.4
D7*
  Bottom 0.305: J8.2 7.11,35.1 8.38,36.38 8.38,50.69 8.5,50.81 8.5,63.75 7.82,64.43 R3.2
D8  (via drill 0.35)
  Top 0.254: v136.25,64.5 135.5,65.25 v135.5,69.25
  Top 0.305: SV7.8 123.5,61.21 123.5,63 124,63.5 125.25,63.5 125.75,63 125.75,61.75 126.5,61 v132.5,61
  Bottom 0.254: v132.5,61 133,61 134.86,62.86 134.86,62.89 136.25,64.28 v136.25,64.5
  Bottom 0.305: v135.5,69.25 138.25,69.25 140.81,71.81 JP11.10
D8*
  Top 0.305: SV5.8 15.54,46.25 12.54,46.25 12.09,45.8 9.5,45.8 9.23,45.53 9.23,44.84 9,44.61 9,40.82 U$1.1
D8_  (via drill 0.25, 0.35 pad 0.6)
  Top 0.254: v153.25,83.75 v125.25,83.75 | v140.75,86.5 140.75,89.75 JP10.7
  Bottom 0.254: U4.6 152.66,84.34 v153.25,83.75 | v153.25,83.75 157,83.75 | 157,83.75 161.45,83.75 U6.6 | U5.6 157.04,83.79 157,83.75 | U1.6 114.63,83.75 119,83.75 | 119,83.75 v125.25,83.75 | U3.6 124.63,83.75 v125.25,83.75 | U2.6 119,84.3 119,83.75 | v125.25,83.75 126.4,83.75 R6.2 | v153.25,83.75 142.75,83.75 140.75,85.75 v140.75,86.5
D9
  Top 0.305: JP11.7 133.19,78.56 132.5,79.25 116.5,79.25 115.75,78.5 115.75,76 116.75,75 119.25,75 120.75,73.5 120.75,61 SV7.6
D9*
  Top 0.305: U$1.2 8.5,42.86 8.5,44.75 8.78,45.03 8.78,46.03 9.01,46.26 11.9,46.26 13.38,47.73 SV5.6
D9_  (via drill 0.35)
  Top 0.305: JP15.1 123.74,96.75 v125.5,96.75 | v126.75,93.75 132,93.75 133,92.75 133,90 JP10.10
  Bottom 0.305: v125.5,96.75 125.5,95 v126.75,93.75
D10  (via drill 0.35)
  Top 0.305: U$2.DIR 126.78,16.54 131.27,16.54 132.68,17.96 132.68,25.4 131.2,26.88 130.37,26.88 v130,27.25 | v130,34.5 131.29,35.79 131.29,54.56 129.43,56.43 117.07,56.43 v117,56.5
  Bottom 0.305: v130,27.25 128.5,28.75 128.5,33 v130,34.5 | v117,56.5 116.94,56.56 SV7.4
D10*
  Top 0.305: U$1.3 8.32,45.22 8.32,46.25 8.78,46.71 9.82,46.71 10.84,47.73 SV5.4
D11  (via drill 0.35)
  Top 0.305: U$2.STEP 124.7,17 131.08,17 132,17.92 v132,24.5 | v131.25,34.5 132,35.25 132,55.25 130,57.25 116.88,57.25 SV7.2
  Bottom 0.305: v132,24.5 132,26.25 129,29.25 129,32.25 v131.25,34.5
D11*
  Top 0.305: U$1.4 8.29,47.73 SV5.2
D12  (via drill 0.35)
  Top 0.305: CONLEFT.DIR 164.08,17.46 152,17.46 149.21,20.25 148.25,20.25 146.71,21.79 146.71,26.02 146,26.73 v146,27.5 | v135,36.25 133.83,37.42 133.83,44.58 v134.25,45
  Bottom 0.305: v135,36.25 135.25,36 138.75,36 143.46,31.29 143.46,30.04 v146,27.5 | v134.25,45 134.18,45.07 129.79,45.07 119.74,55.11 116.28,55.11 115.47,55.92 115.47,61.39 114.58,62.27 SV7.1
D12*
  Top 0.305: U$1.5 8.23,49.1 SV5.1
D13  (via drill 0.35)
  Top 0.305: CONLEFT.STEP 162,17 151.56,17 148.77,19.79 148.06,19.79 146.25,21.6 146.25,25.83 144.58,27.5 v141.5,27.5 | v134.25,35.5 133.37,36.38 133.37,45.62 v133.75,46
  Bottom 0.305: v141.5,27.5 141.96,27.96 141.96,31.94 138.55,35.35 134.4,35.35 v134.25,35.5 | v133.75,46 129.75,46 120.18,55.57 116.72,55.57 115.92,56.36 115.92,61.4 116.79,62.27 SV7.3
D13*
  Top 0.305: SV5.3 10.84,50.27 9.82,51.29 7.48,51.29 U$1.6
GND  (via drill 0.25, 0.35, 0.55)  (129 unrouted)
  Top 0.254: D3.C 179.04,101.8 v179,101.75
  Top 0.305: D1.C 163.75,2.24 | v6.75,37 v10,37 | S2.5 9,12.06 v9,12.25 | JP12.8 131.49,71.34 v131.25,71.34 | v136.75,73.25 135.5,74.5 v128.5,74.5 | v120.5,92.5 v123,92.5
  Top 0.406: v108.75,20 116,20 116.88,20.88 116.88,23.37 116.25,24 v108.75,24 | v166,20 165.75,20.25 157.75,20.25 157.25,20.75 157.25,23.5 157.75,24 v166,24
  Top 0.508: v150.5,69 150.5,71 v150.25,71.25 | Q2.E 139.25,104.48 v139.25,99 | v130.5,97.5 v130.5,95 | v118,103 116.75,101.75 v116.75,99.75 | v108,101.75 107.75,101.5 v107.75,98.75 | v120.75,86.25 120,87 v118.75,87
  Top 0.61: SV7.9 124.56,61.69 126.52,59.73 SV7.12 | v123,50.25 v125.5,52.75
  Top 0.813: v143.75,4.75 v143.75,2.75 | D1.C 162.35,2.15 v162.25,2.25 | C15.1 118.5,20.4 v118.5,19.75 | v166,40.5 165.5,41 v161,41 158.84,41 | v134.5,33 137,35.5 v137,38.5 | U$2.GND0 112.05,29.75 124.49,29.75 U$2.GND1 | v116.5,5.75 116.5,2.25 v116.25,2
  Top 1.27: CONLEFT.GND0 150.65,24.1 153,21.75 C14.1 155.25,20.9 v155.25,20.5
  Bottom 0.203: v9,12.25 9.25,12.5
  Bottom 0.305: 151.62,67.03 LED1.4
  other vias: 166,38.5 166,42.5 166,44.5 166,49.5 108,44.5 108,42.5 108,40.5 108,38.5 108,49.5 108,51.5 108,53.5 108,55.5 166,55.5 166,53.5 166,51.5 158.81,41
N$1
  Bottom 0.254: R22.2 IRLED8.1
N$2
  Bottom 0.254: R8.2 IRLED1.1
N$3
  Top 0.254: R28.2 135.33,103.9 D6.A
N$4
  Top 1.016: JP23.4 157.27,58.52 156,57.25 151.75,57.25 150.6,58.4 D7.C
N$5
  Top 0.305: JP14.2 158.5,103.57 S6.1
N$6
  Bottom 0.254: R31.2 IRLED0.1
N$7
  Bottom 0.254: JP1.1 151.62,69.86 151.62,70 | 151.62,70 LED1.1 | IC3.4 149.5,70.16 151.47,70.16 151.62,70
  Bottom 0.305: JP13.2 149.5,70.16
N$8
  Bottom 0.254: JP3.1 159.62,33.78 159.62,34 LED3.1 | JP2.2 161.38,51.77 LED2.3
  Bottom 0.305: 159.62,34 159.57,34.06 159.57,49.44 LED2.3
N$9  (via drill 0.2)
  Top 0.254: v161.5,26.75 159.5,24.75 157.5,24.75 156.5,23.75 v156.5,18.25
  Bottom 0.254: JP4.1 160,6.88 LED4.1 158.25,8.62 158.25,12.5 157,13.75 157,17.75 v156.5,18.25 | JP3.2 161.38,31.22 LED3.3 162.25,29.88 162.25,28.83 162.23,28.81 162.23,27.89 162.25,27.87 162.25,27.5 v161.5,26.75
N$10
  Bottom 0.254: LED5.1 137.88,6 JP5.1 | JP4.2 160.88,4.72 LED4.3
  Bottom 0.305: LED5.1 158.15,6.88 159.49,5.53 159.94,5.53 JP4.2
N$11
  Bottom 0.254: LED5.3 136.12,6 JP5.2
  Bottom 0.305: LED5.3 134.62,4.5 LED6.1 114,5.38 JP6.1
N$12  (via drill 0.35)
  Top 0.305: v119.5,17 119.5,19.67 120.68,20.84 121.43,20.84 121.6,21.02 121.6,21.77 v122.33,22.5
  Bottom 0.305: v119.5,17 119.5,14.38 113.19,8.06 | v122.33,22.5 116.87,27.96 116.87,29.25 LED7.1 114.38,32.08 JP7.1 | LED6.3 113.19,8.06 | JP6.2 113.19,7.47 113.19,8.06
N$13
  Bottom 0.254: R10.2 IRLED2.1
N$14  (via drill 0.35)
  Top 0.305: v114.25,37 v114.25,49
  Bottom 0.254: JP8.1 114.38,51.72 LED8.1
  Bottom 0.305: JP7.2 113.36,34.52 LED7.3 114.25,36.88 v114.25,37 | v114.25,49 114.38,49.12 LED8.1
N$15  (via drill 0.35)
  Top 0.305: v115,66 v115,68.25
  Bottom 0.254: JP8.2 112.62,54.28 LED8.3 112.62,55.5
  Bottom 0.305: 112.62,55.5 112.62,57.09 112.81,57.27 112.81,63.81 v115,66 | v115,68.25 116.33,68.25 117.68,69.6 119.15,69.6 119.5,69.25 119.5,68.5 120,68 121.75,68 122.41,67.34 LED9.1
N$16
  Top 0.305: R1.2 D1.A
N$17  (via drill 0.6)
  Top 1.016: v121.52,18.25 129.94,18.25 SV1.1
  Bottom 1.016: U$2.B2 113.19,28.22 114.56,26.85 114.97,26.85 119.87,21.96 119.87,19.9 v121.52,18.25
N$18  (via drill 0.6)
  Top 1.016: v121.93,20.15 129.42,20.15 SV1.2
  Bottom 1.016: U$2.B1 115.73,27.85 121.29,22.29 121.29,20.78 v121.93,20.15
N$19
  Bottom 1.016: SV1.3 123.6,23.27 118.52,28.35 U$2.A1
N$20
  Bottom 1.016: U$2.A2 123.35,25.81 SV1.4
N$21
  Top 0.254: R30.2 D5.A
N$23
  Top 0.254: R4.2 173.94,103.5 D3.A
N$24
  Bottom 0.254: R12.2 IRLED3.1
N$27
  Bottom 1.016: CONLEFT.B2 153.19,28.15 150.85,25.81 SV2.1
N$28
  Bottom 0.813: CONLEFT.B1 155.73,28.3
  Bottom 1.016: SV2.2 150.7,23.27 155.73,28.3
N$29  (via drill 0.6)
  Top 1.016: v153.67,23.83 158.19,28.35 CONLEFT.A1
  Bottom 1.016: SV2.3 150.57,20.73 v153.67,23.83
N$30  (via drill 0.6)
  Top 1.016: v158.83,26.45 158.91,26.45 CONLEFT.A2
  Bottom 1.016: v158.83,26.45 156.2,26.45 155,25.25 155,22.75 150.44,18.19 SV2.4
N$31
  Top 1.27: J3.2 151.3,13 158.18,13 S3.2
N$33
  Bottom 0.305: Q1.2 6.2,70.91 LS1.+
N$34
  Bottom 0.305: R3.1 6.2,66.34 Q1.1
N$35
  Bottom 0.254: IC4.3 128.22,52.22 128.5,52.5 133,52.5 133,53.5 | R5.1 133.1,53.6 133,53.5 | 133,53.5 132.9,53.6 R2.2
N$45  (via drill 0.35)
  Top 0.508: v112.5,48 112.5,31.75 v113.5,30.75 | v163,30.5 162.03,31.47 v162.03,39.75 | v117,18.25 117.5,18.75 117.5,20.97 117.49,20.98 117.49,22.02 117.5,22.03 117.5,24.25 117,24.75 v112,24.75 | v126.75,65 127.98,66.23 128.25,66.23 129,66.99 v129,68.75 | v138.25,71.25 138.22,71.28 138.22,74.58 138.68,75.03 139.32,75.03 139.36,75 142.25,75 143.75,73.5 JP9.1
  Bottom 0.406: C5.1 140.64,5.12 LED5.2
  Bottom 0.508: 153.38,72.62 155.46,70.54 C1.1 | 161.38,56.14 LED2.2 161.75,54.75 162.46,54.04 162.46,40.18 v162.03,39.75 162.03,36.5 161.54,36.01 C3.1 160.92,34.71 LED3.2 | 161.38,56.14 C2.1 | C8.1 112.54,49.71 | 112.54,49.71 112.62,49.8 LED8.2 112.62,51.94 111.79,52.77 111.79,57.04 112.25,57.5 112.25,64.75 114.54,67.04 C9.1 120.69,66.96 LED9.2 121.9,65.75 123.75,65.75 124.5,65 v126.75,65 | C7.1 112.62,31.06 LED7.2 | LED4.2 161.13,7.49 162,7.49 | 162,7.49 C4.1 163.14,11.36 159.51,14.98 159.51,16.92 156.59,19.84 156.59,24.17 157.58,25.16 161.92,25.16 164.59,27.83 164.59,29.75 163.85,30.5 v163,30.5 | C7.1 112.93,30.18 v113.5,30.75 | v112.5,48 112.54,48.29 112.54,49.71 | 162,7.49 162,3.5 161.25,2.75 159.12,2.75 156.12,5.75 153.5,5.75 151.5,3.75 140.65,3.75 | JP9.1 143.75,71.25 145.25,72.75 153.25,72.75 153.38,72.62 | C5.1 140.65,3.75 | v117,18.25 117.03,18.22 117.03,14.03 112,9 112,5.62 LED6.2 113.85,3.78 C6.1 115.5,3 116.25,3.75 140.65,3.75 | C7.1 111.94,29.98 111.94,24.81 v112,24.75 | v129,68.75 129.03,68.78 130.79,68.78 131.51,69.5 131.51,70.48 132.29,71.27 133.88,71.27 134.18,70.97 137.97,70.97 arc90 v138.25,71.25 | 161.38,56.14 161.38,61.16 157.98,64.56 157.44,64.56 154.25,67.75 154.25,69.62 LED1.2 153.38,72.62
N$47
  Bottom 0.254: R14.2 IRLED4.1
N$51
  Bottom 0.254: R16.2 IRLED5.1
N$55
  Bottom 0.254: R18.2 IRLED6.1
N$59
  Bottom 0.254: R20.2 IRLED7.1
N$68
  Bottom 0.254: R24.2 IRLED9.1
N$69  (via drill 0.35)
  Top 0.305: S5.2 JP15.2 124.49,101.01 v126,99.5 | v148.5,96.25 152.75,100.5 JP14.1
  Bottom 0.305: v126,99.5 126.84,98.66 126.84,97.2 127.98,96.07 143.53,96.07 143.72,96.25 v148.5,96.25
N$73
  Bottom 0.305: R26.2 IRLED10.1
N$85
  Bottom 0.254: JP2.1 159.62,54.33 LED2.1 | JP1.2 153.38,67.3
  Bottom 0.305: 153.38,67.3 LED1.3 153.38,65.62 155,64 157.75,64 159.62,62.12 LED2.1
N$86
  Top 1.27: S3.3 165.37,4.17 D4.A 162.13,4.14 161.77,4.5 SJ1.1
PTB18*  (via drill 0.35)
  Top 0.305: S2.4 | v7,13.75 6.8,13.55 S2.4
  Bottom 0.305: J8.15 9.6,16.35 v7,13.75
PTB19*
  Top 0.305: J8.13 8.35,21.11 6.54,21.11 5.61,20.17 5.61,10.93 7.06,9.48 8.43,9.48 S2.6 | S2.6
PTC0*  (via drill 0.5)
  Top 0.305: S2.1 2.92,8 v3,8
  Bottom 0.305: v3,8 3,8.44 2.39,9.05 2.39,11.39 5.75,14.75 5.75,28.5 6,28.75 8.75,28.75 9.6,29.6 J8.5
PTC1  (via drill 0.35)
  Top 0.254: v121.5,71.5 121.55,71.45 122,71.45 v124.45,71.45 124.77,71.45 125.48,72.16 126.17,72.16 126.87,71.45 128.8,71.45 v129,71.25
  Top 0.305: SV6.4 121,33.02 121,37.25 121.79,38.04 121.79,39.44 123.44,41.08 128.94,41.08 130.63,42.77 130.63,49.37 124.25,55.75 113.25,55.75 112.25,56.75 112.25,63.75 113.25,64.75 v118.25,64.75 | v122,64.75 122,71.45
  Bottom 0.254: U7.6 124.54,71.54 v124.45,71.45 | v121.5,71.5 120.38,72.62 R32.2 | v129,71.25 129.29,71.54 U8.6
  Bottom 0.305: v118.25,64.75 v122,64.75
PTC1*
  Top 0.305: SV4.4 13.61,19.73 12.59,20.75 11.12,20.75 10.81,21.06 J8.11
PTC5  (via drill 0.35)
  Top 0.305: U$2.EN 110.39,13.37 134.33,13.37 135.34,14.38 135.34,26.16 v134,27.5 | v131.75,30.5 127.98,34.27 SV6.9
  Bottom 0.305: v134,27.5 131.75,29.75 v131.75,30.5
PTC5*
  Bottom 0.305: SV4.9 21.23,22.27 19.54,23.96 11.75,23.96 11.46,24.25 11.46,31.35 10.8,32.01 10.84,32.05 10.84,33.86 J8.1
PTC7  (via drill 0.35)
  Top 0.305: CONLEFT.EN 141.4,15.65 v141.25,15.5 | v137,27.5 v137,15.5
  Bottom 0.305: v141.25,15.5 v137,15.5 | v137,27.5 134.75,29.75 v134.75,30.5 133.25,32 133.25,33.75 131.5,35.5 125.75,35.5 124.79,34.54 SV6.7
PTC7*
  Bottom 0.305: SV4.7 18.56,23.5 11.5,23.5 11,24 11,31.16 J8.3
PTC8*  (via drill 0.5)
  Top 0.305: S2.3 4.85,5.9 v4.9,5.9
  Bottom 0.305: v4.9,5.9 5.32,5.9 5.92,5.3 7.32,5.3 8.31,6.3 8.31,7.7 7,9.01 7,12.5 11,16.5 11,23.35 10.54,23.81 10.54,24 J8.9
PTC9*  (via drill 0.5)
  Top 0.305: S2.2 3.94,7 v4,7
  Bottom 0.305: v4,7 5.48,8.48 5.48,13.48 8.3,16.3 8.3,27 8.79,27.48 J8.7
PTE26  (via drill 0.35)
  Top 0.305: J1.1 138.5,66.5 v138.5,64.25 | v132,58 126.29,58 SV7.10
  Bottom 0.305: v132,58 132.25,58 134.08,59.83 137.9,59.83 139.17,61.1 139.17,62.9 138.5,63.57 v138.5,64.25
PTE26*
  Top 0.305: J7.1 9.75,40.75 9.5,41 9.5,44.46 9.69,44.65 9.69,45.19 9.84,45.34 12.28,45.34 12.73,45.79 15.79,45.79 16.5,46.5 18.75,46.5 19.56,47.31 SV5.10
SCL  (via drill 0.35)
  Top 0.254: v134.81,64.44 134.81,69.94 v134.75,70
  Top 0.305: SV3.3 111.05,7.58 115.93,12.46 134.71,12.46 136.25,14 136.25,27.25 v135.97,27.53 | v133.75,30.5 132.91,31.34 132.91,46.66 v133.25,47 | v129.25,55.25 v126.75,55.25
  Bottom 0.305: JP11.9 138.27,76.23 140.25,74.25 140.25,72 138.25,70 v134.75,70 | v134.81,64.44 132.92,64.44 JP27.2 129.52,63.5 123.25,63.5 SV7.7 122.02,62.48 121,63.5 118.75,63.5 118.25,63 118.25,58.67 121.71,55.21 | v135.97,27.53 133.75,29.75 v133.75,30.5 | v133.25,47 133.18,47.07 129.85,47.07 121.71,55.21 | IC4.5 129.25,54.54 v129.25,55.25 | v126.75,55.25 121.75,55.25 121.71,55.21
SCL*
  Top 0.305: SV5.7 15.92,50.27 14.9,51.29 14.06,51.29 14.05,51.27 13.02,51.27 12.55,51.74 10.66,51.74 10.2,52.2 9.01,52.2 8.96,52.25 8.96,59.97 U$1.10
SDA  (via drill 0.35)
  Top 0.305: JP11.8 135.73,77.98 134,79.71 116.31,79.71 115.29,78.69 115.29,75.81 119.48,71.62 SV7.5 | SV3.4 112.94,10.12 115.74,12.92 134.52,12.92 135.79,14.19 135.79,26.71 v135,27.5 | v132.75,30.5 132.46,30.79 132.46,47.71 v132.75,48
  Bottom 0.305: SV7.5 120.75,61 129.48,61 JP27.1 128.22,57.2 IC4.4 128.22,52.84 127.37,51.98 127.37,50.44 129.75,48.07 132.68,48.07 v132.75,48 | v135,27.5 132.75,29.75 v132.75,30.5
SDA*
  Top 0.305: SV5.5 13.38,50.27 12.36,51.29 10.47,51.29 10.01,51.74 8.75,51.74 8.5,51.99 8.5,57.89 U$1.9
VIN  (via drill 0.35, 0.55)
  Top 0.305: 157.19,4.17 R1.1
  Top 0.406: v137,56.25 140,56.25
  Top 1.016: 124.34,26 124.34,21.56 C15.2 | CONLEFT.VMOT 148.11,23.24 C14.2 | D7.A 145.9,48.65 v145.75,48.5
  Top 1.27: 140,29 140,10.5 146.36,4.14 D4.C 155.21,4.17 157.19,4.17 159.15,4.17 159.23,4.25 SJ1.2 | 140,29 140,48.5 | 140,48.5 140,56.25 140,68.75 138.92,69.83 136.77,69.83 135.83,70.77 135.83,72.17 135,73 127.75,73 125.57,75.18 JP11.4 | 140,48.5 v145.75,48.5 v154,48.5 | U$2.VMOT 108.11,26.89 109,26 124.34,26 127,26 130,29 140,29 | 140,29 147.46,29 CONLEFT.VMOT
  Bottom 0.305: R2.1 132.85,56.25 v137,56.25
  Bottom 0.508: IC2.3 145.81,53.41 C12.1 | IC1.3 154.31,53.41 C10.1
  Bottom 1.016: IC2.3 145.81,48.63 v145.75,48.5 | v154,48.5 154.31,48.81 IC1.3
VIN*
  Top 1.27: JP21.4 55.5,44.5 55.5,35.75 56.15,35.1 J5.8
(copper drawn outside any net)
  shapes: Bottom area x12, Top area x6

## Text on the board
tPlace: A0 | A1 | A2 | VIN | NC | GND | D9 | SDA | SCL | D8 | GND | 5V | 3V3 | A3 | A4 | A5 | A0 | A1 | A2 | VIN | NC | GND | D9 | SDA | SCL | D8 | GND | 5V | 3V3 | A3 | A4 | A5 | A0 | 3V3 | 5V | GND | BUZZER | A0 | 3V3 | 5V | GND | D12 | D13 | SDA | SCL | GND | 5V | A0 | GND | SCL | SDA | D11 | D10 | D9 | D8 | PTE26 | GND | A1 | VIN | AREF | GND | NC | D13 | 3V3 | D12 | RST | LEFT STEPPER MOTOR / NEMA 8 | RIGHT STEPPER MOTOR / NEMA 8 | D11 | 3V3 | D10 | 5V | D9 | GND | D8 | PTE26 | GND | D4 | D5 | D6 | PTC7 | PTC5 | GND | 5V | D5 | A2 | A3 | D7 | PTC5 | VIN | PTC7 | D6 | D5 | PTC0 | A0 | D2 | PTC1 | D3 | D1 | D0 | GND | 5V | D3 | A4 | A5 | D4 | PTC9 | A1 | VIN | GND | B2 | B1 | A1 | A2 | FLT | GND | VMOT | D2 | B2 | B1 | A1 | A2 | FLT | GND | D3 | PTC8 | A2 | D2 | A3 | D1 | A4 | D0 | PTB18 | A5 | EN | M0 | M1 | CONF | VREF | SLP | STEP | DIR | EN | M0 | M1 | CONF | VREF | SLP | STEP | DIR | SDA | Joystick | SCL | 3V3 | 3 | 1 | 1 | 3 | GND | 2 | 2
bPlace: THIS SIDE FACES DOWN!! | THIS SIDE FACES DOWN!! | THIS SIDE FACES DOWN!! | THIS SIDE FACES DOWN!! | THIS SIDE FACES DOWN!! | :) | 1 | 1 | 3 | 3 | 2 | 2
tNames: LINE SENSOR MODULE v1.0
bNames: 3.3V | 5V | by Jakub Pánek | Steppy Mk2 v1.0 | Licensed under MIT license | https://github.com/jakubpanek/SteppyMk2